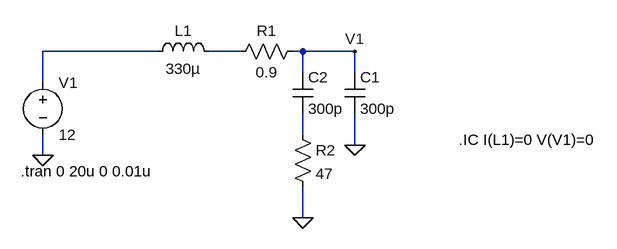
[diagram p0: schematic Draft1.asc]
Draft1.asc, the LTspice schematic file:
Version 4
SHEET 1 928 680
WIRE 208 80 32 80
WIRE 336 80 288 80
WIRE 432 80 416 80
WIRE 512 80 432 80
WIRE 432 112 432 80
WIRE 512 112 512 80
WIRE 32 128 32 80
WIRE 432 208 432 176
WIRE 512 224 512 176
WIRE 32 240 32 208
WIRE 432 336 432 288
FLAG 32 240 0
FLAG 512 224 0
FLAG 512 80 V1
FLAG 432 336 0
SYMBOL voltage 32 112 R0
SYMATTR InstName V1
SYMATTR Value 12
SYMBOL ind 192 96 R270
WINDOW 0 32 56 VTop 2
WINDOW 3 5 56 VBottom 2
SYMATTR InstName L1
SYMATTR Value 330µ
SYMBOL res 432 64 R90
WINDOW 0 0 56 VBottom 2
WINDOW 3 32 56 VTop 2
SYMATTR InstName R1
SYMATTR Value 0.9
SYMBOL cap 496 112 R0
SYMATTR InstName C1
SYMATTR Value 300p
SYMBOL cap 416 112 R0
SYMATTR InstName C2
SYMATTR Value 300p
SYMBOL res 416 192 R0
SYMATTR InstName R2
SYMATTR Value 47
TEXT -2 264 Left 2 !.tran 0 20u 0 0.01u
TEXT 672 216 Left 2 !.IC I(L1)=0 V(V1)=0

The netlist it stands for:
* Draft1.asc
V1 N001 0 12
L1 N001 N002 330µ
R1 V1 N002 0.9
C1 V1 0 300p
C2 V1 N003 300p
R2 N003 0 47
.tran 0 20u 0 0.01u
.IC I(L1)=0 V(V1)=0
.backanno
.end